# EAGLE schematic object counter (EAGLE 6.1)
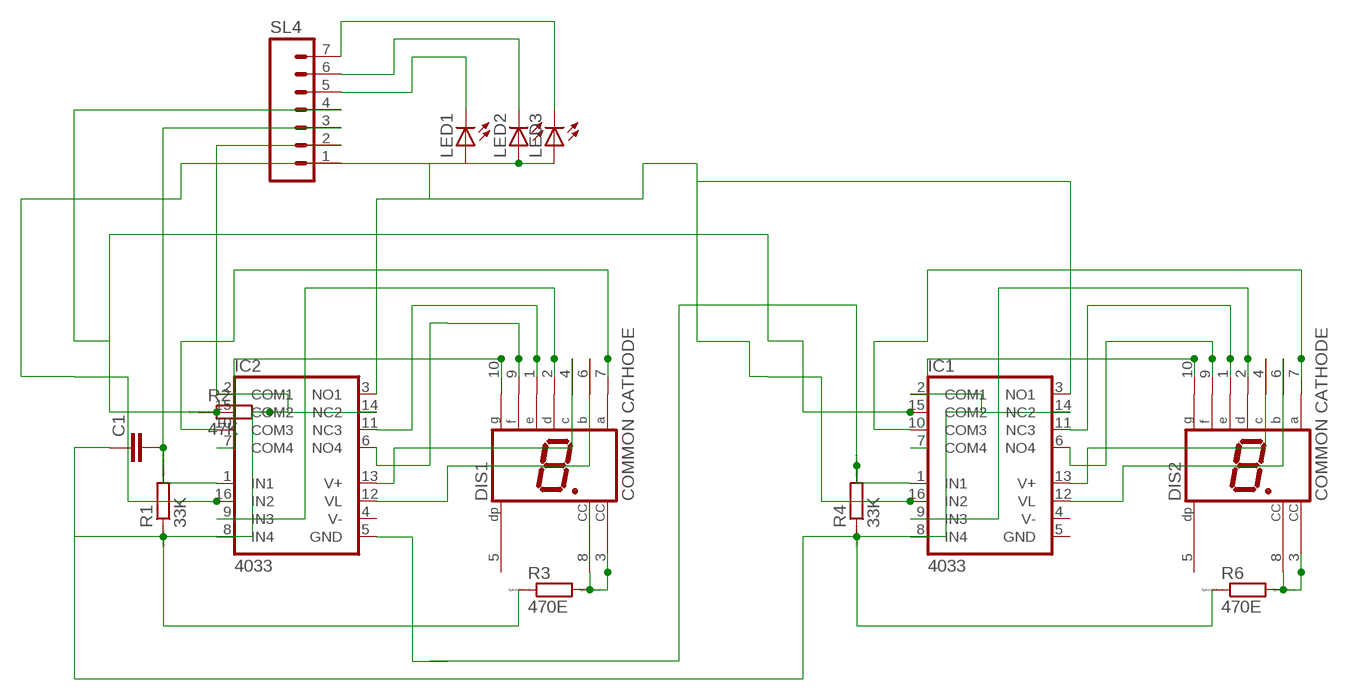
[diagram p0: schematic, sheet 1]

## Parts
C1  C2,5-3  [C2.5-3]
DIS1  COMMON CATHODE  HD-H103  [HDSP-M]
DIS2  COMMON CATHODE  HD-H103  [HDSP-M]
IC1  4033  MAX314EPE  [DIL16]
IC2  4033  MAX314EPE  [DIL16]
LED1  LED5MM  [LED5MM]
LED2  LED5MM  [LED5MM]
LED3  LED5MM  [LED5MM]
R1  33K  R0204/7  [0204/7]
R2  47K  R0204/7  [0204/7]
R3  470E  R0204/7  [0204/7]
R4  33K  R0204/7  [0204/7]
R6  470E  R0204/7  [0204/7]
SL4  M07  [07P]

## Nets
N$1: C1.1 IC1.2(COM1) IC1.8(IN4) IC1.14(NC2) IC2.2(COM1) IC2.8(IN4) IC2.14(NC2) R1.1 R2.2 R3.1 R4.1 R6.1 SL4.2
N$3: DIS1.3(CC) DIS1.8(CC) R3.2
N$4: C1.2 IC2.1(IN1) R1.2 SL4.3
N$5: DIS1.7(A) IC2.10(COM3)
N$6: DIS1.6(B) IC2.12(VL)
N$7: DIS1.4(C) IC2.13(V+)
N$8: DIS1.2(D) IC2.9(IN3)
N$9: DIS1.1(E) IC2.11(NC3)
N$10: DIS1.9(F) IC2.6(NO4)
N$11: DIS1.10(G) IC2.7(COM4)
N$12: IC1.15(COM2) IC2.15(COM2) R2.1 SL4.4
N$13: IC1.3(NO1) IC1.16(IN2) IC2.3(NO1) IC2.16(IN2) LED1.A LED2.A LED3.A SL4.1
N$15: DIS2.3(CC) DIS2.8(CC) R6.2
N$16: IC1.1(IN1) IC2.5(GND) R4.2
N$17: DIS2.7(A) IC1.10(COM3)
N$18: DIS2.6(B) IC1.12(VL)
N$19: DIS2.4(C) IC1.13(V+)
N$20: DIS2.2(D) IC1.9(IN3)
N$21: DIS2.1(E) IC1.11(NC3)
N$22: DIS2.9(F) IC1.6(NO4)
N$23: DIS2.10(G) IC1.7(COM4)
N$24: LED1.K(C) SL4.5
N$25: LED2.K(C) SL4.6
N$26: LED3.K(C) SL4.7
Unconnected: DIS1.5(DP) DIS2.5(DP)

## Power pins joined to a net without a drawn wire
GND: IC1.5(GND)
V-: IC1.4(V-) IC2.4(V-)

## Library data of the parts
C1 = capacitor-wima:C: CAPACITOR naming: grid - package width
DIS1 DIS2 = display-hp:HD-H103: LED DISPLAY 1-character 7 segment, decimal point right; OC_FARNELL: unknown; OC_NEWARK: unknown
IC1 IC2 = maxim:MAX314: 10?, Quad, SPST, CMOS Analog Switches Source: http://datasheets.maxim-ic.com/en/ds/MAX312-MAX314.pdf; MPN: MAX314EPE+; OC_FARNELL: unknown; OC_NEWARK: 99K3225
LED1-LED3 = led:LED: LED OSRAM: - CHIPLED LG R971, LG N971, LY N971, LG Q971, LY Q971, LO R971, LY R971 LH N974, LH R974 LS Q976, LO Q976, LY Q976 LO Q996 - Hyper CHIPLED LW Q18S LB Q993, LB Q99A, LB R99A - SideLED LS A670, LO A670, LY A670, LG A670, LP A670 LB A673, LV A673, LT A673, LW A673 LH A674 LY A675 LS A676, LA A676, LO A676, LY A676, LW A676 LS A679, LY A679, LG A679 - Hyper Micro SIDELED® LS Y876, LA Y876, LO Y876, LY Y876 LT Y87S - SmartLED LW L88C, LW L88S LB L89C, LB L89S, LG L890 LS L89K, LO L89K, LY L89K LS L896, LA L896, LO L896, LY L896 - TOPLED LS T670, LO T670, LY T670, LG T670, LP T670 LSG T670, LSP T670, LSY T670, LOP T670, LYG T670 LG T671, LOG T671, LSG T671 LB T673, LV T673, LT T673, LW T673 LH T674 LS T676, LA T676, LO T676, LY T676, LB T676, LH T676, LSB T676, LW T676 LB T67C, LV T67C, LT T67C, LS T67K, LO T67K, LY T67K, LW E67C LS E67B, LA E67B, LO E67B, LY E67B, LB E67C, LV E67C, LT E67C LW T67C LS T679, LY T679, LG T679 LS T770, LO T770, LY T770, LG T770, LP T770 LB T773, LV T773, LT T773, LW T773 LH T774 LS E675, LA E675, LY E675, LS T675 LS T776, LA T776, LO T776, LY T776, LB T776 LHGB T686 LT T68C, LB T68C - Hyper Mini TOPLED® LB M676 - Mini TOPLED Santana® LG M470 LS M47K, LO M47K, LY M47K Source: http://www.osram.convergy.de LUXEON: - LUMILED® LXK2-PW12-R00, LXK2-PW12-S00, LXK2-PW14-U00, LXK2-PW14-V00 LXK2-PM12-R00, LXK2-PM12-S00, LXK2-PM14-U00 LXK2-PE12-Q00, LXK2-PE12-R00, LXK2-PE12-S00, LXK2-PE14-T00, LXK2-PE14-U00 LXK2-PB12-K00, LXK2-PB12-L00, LXK2-PB12-M00, LXK2-PB14-N00, LXK2-PB14-P00, LXK2-PB14-Q00 LXK2-PR12-L00, LXK2-PR12-M00, LXK2-PR14-Q00, LXK2-PR14-R00 LXK2-PD12-Q00, LXK2-PD12-R00, LXK2-PD12-S00 LXK2-PH12-R00, LXK2-PH12-S00 LXK2-PL12-P00, LXK2-PL12-Q00, LXK2-PL12-R00 Source: www.luxeon.com KINGBRIGHT: KA-3528ASYC Source: www.kingbright.com
R1-R4 R6 = eagle-ltspice:R: RESISTOR, European symbol; SPICEMODEL: NONE; SPICEPREFIX: R
SL4 = con-amp-quick:M07: AMP QUICK CONNECTOR; OC_FARNELL: unknown; OC_NEWARK: unknown